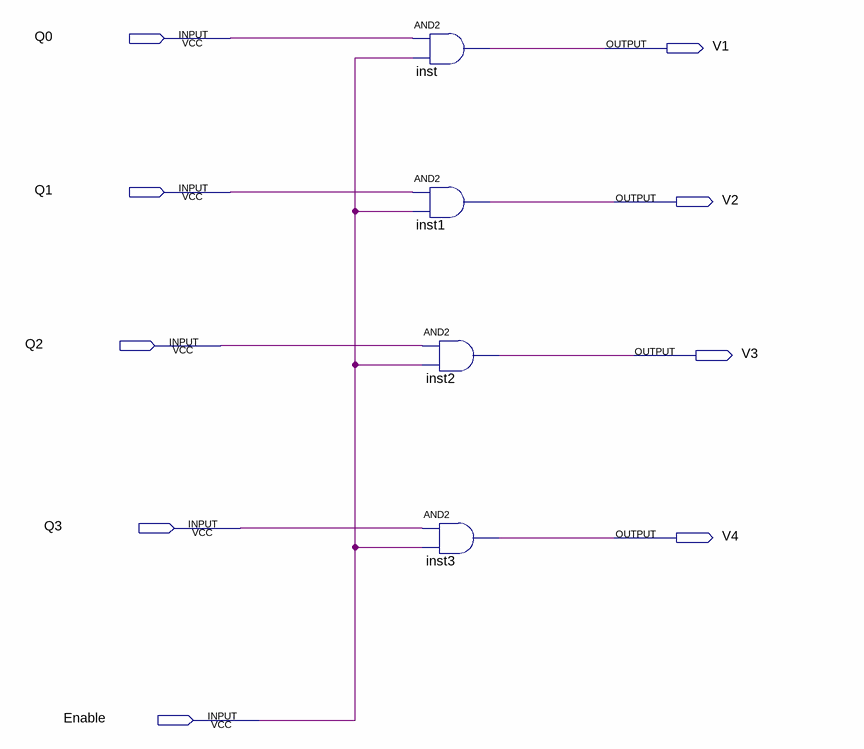
[diagram p0: schematic sheet]
// Quartus schematic POP.bdf as structural Verilog: 4 symbols, 9 pins
module POP (
  input  Q0,
  input  Q1,
  input  Q2,
  input  Q3,
  input  Enable,
  output V1,
  output V2,
  output V3,
  output V4
);

  and inst (V1, Q0, Enable);
  and inst1 (V2, Q1, Enable);
  and inst2 (V3, Q2, Enable);
  and inst3 (V4, Q3, Enable);
endmodule
